# Altium schematic sheet AutomaticSolarTracker.SchDoc
size 863 x 558 mm; SheetNumber: 1; SheetTotal: 1
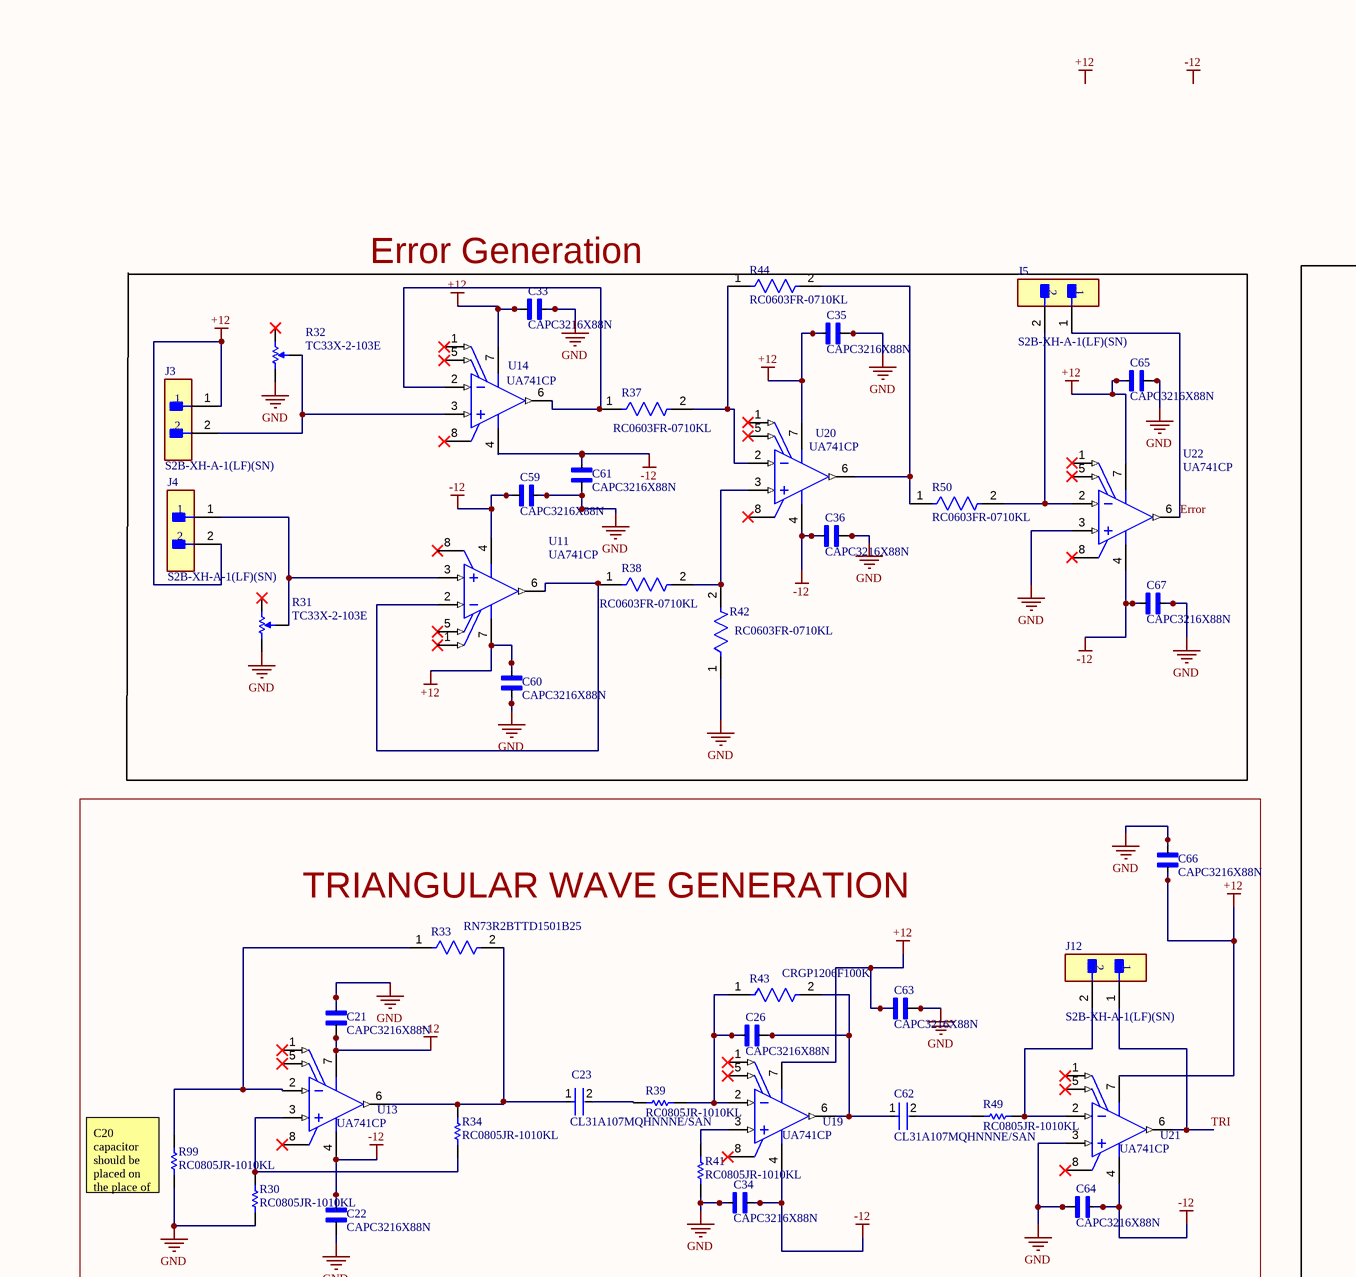
[diagram p0: AutomaticSolarTracker.SchDoc, top left]
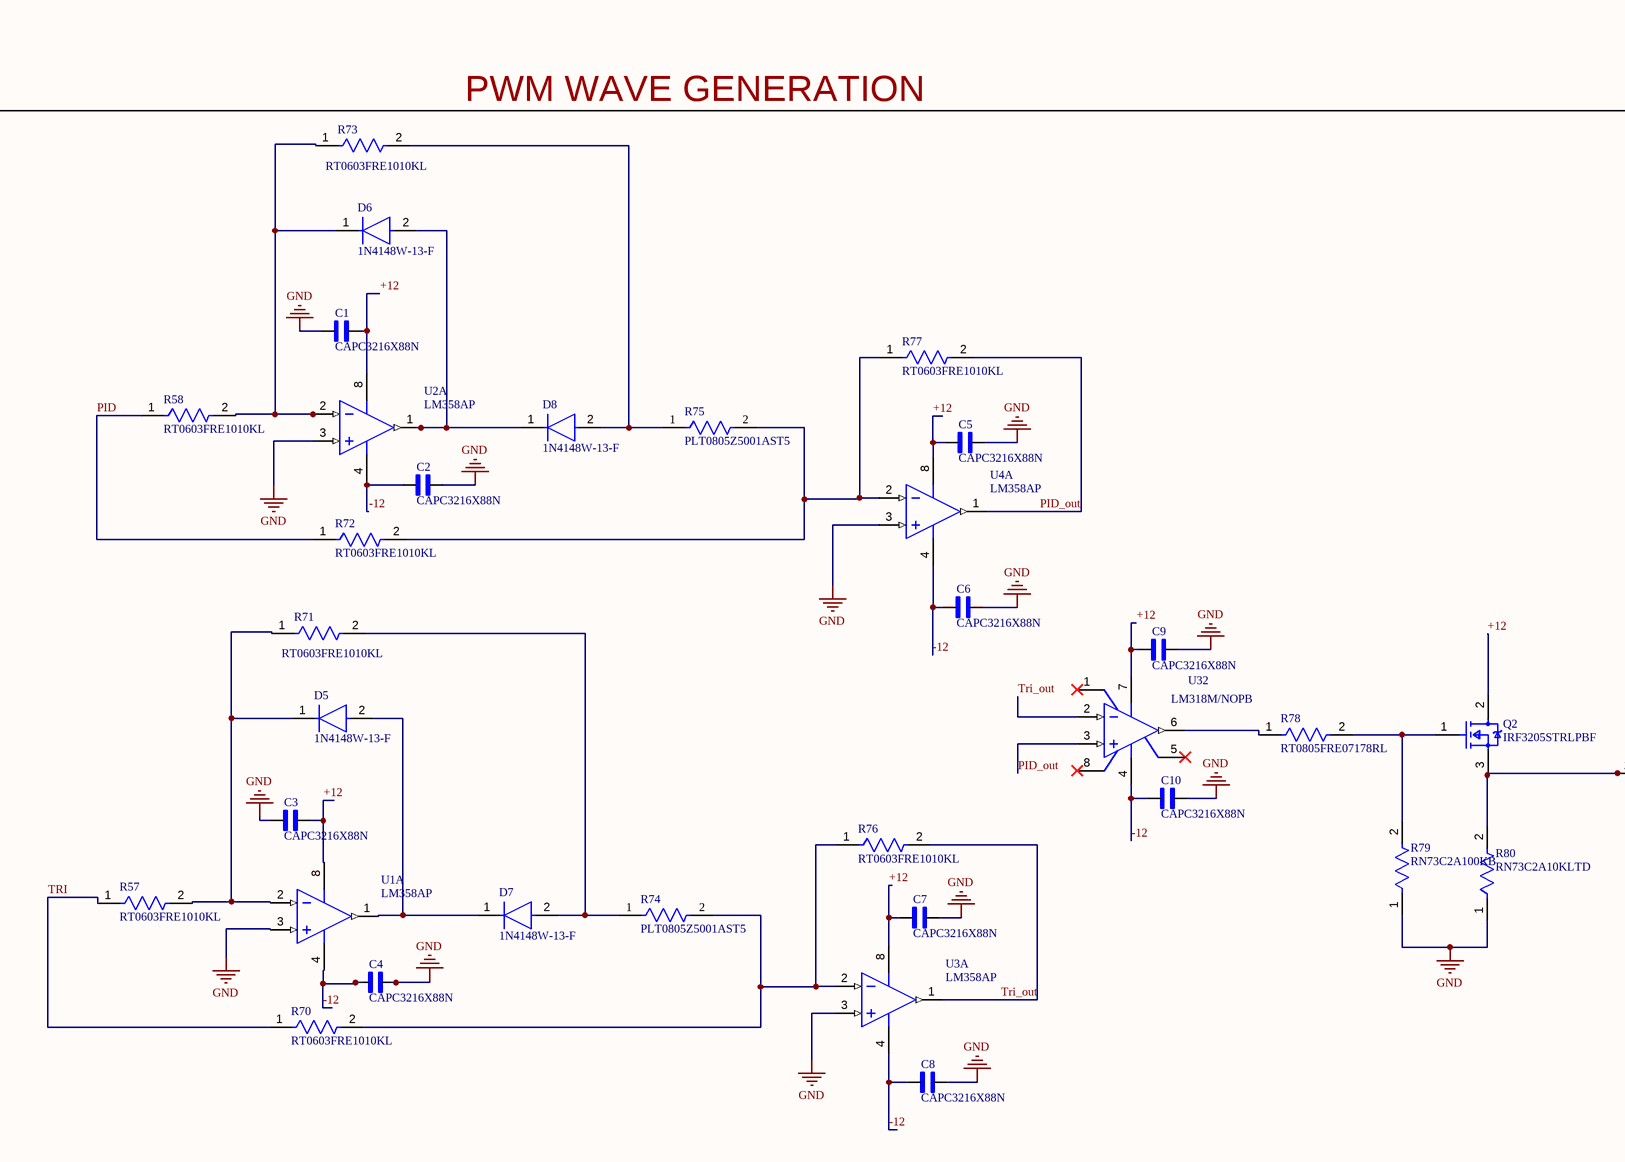
[diagram p1: AutomaticSolarTracker.SchDoc, top middle]
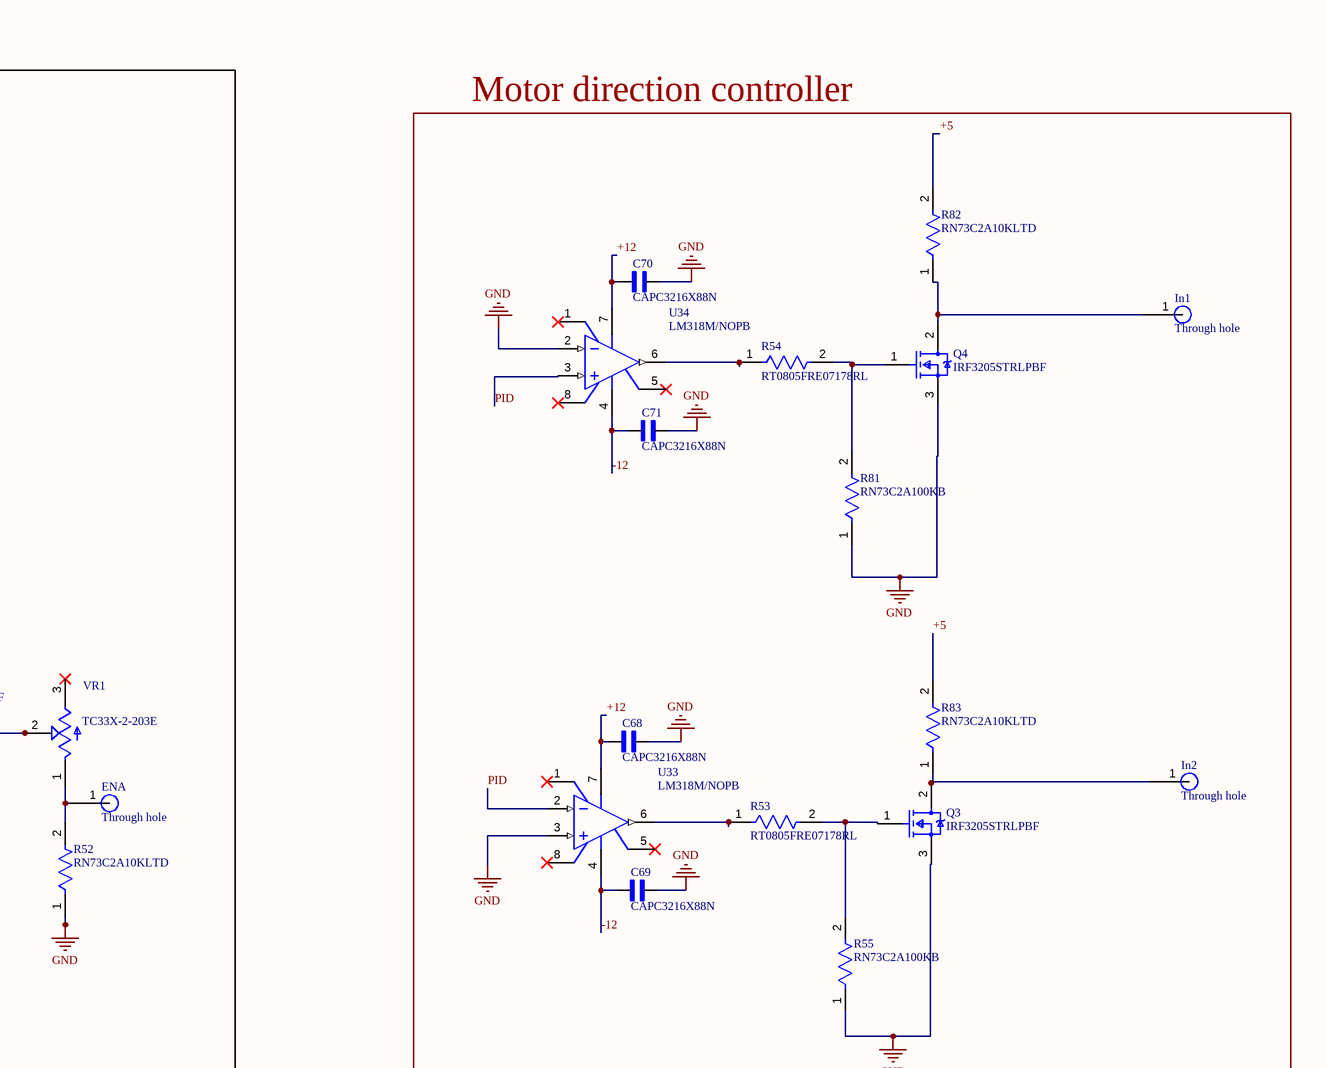
[diagram p2: AutomaticSolarTracker.SchDoc, top right]
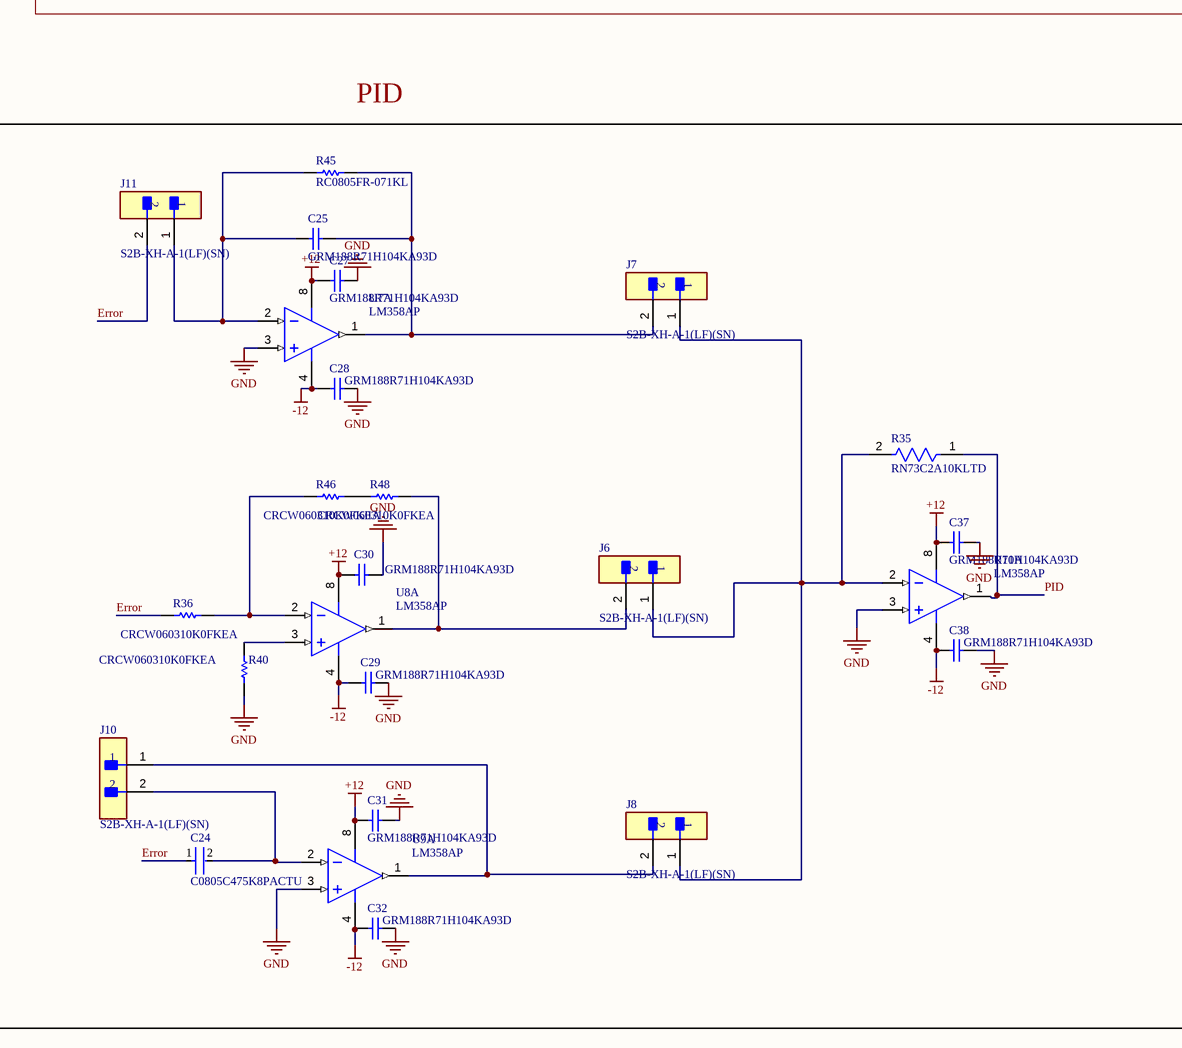
[diagram p3: AutomaticSolarTracker.SchDoc, bottom left]
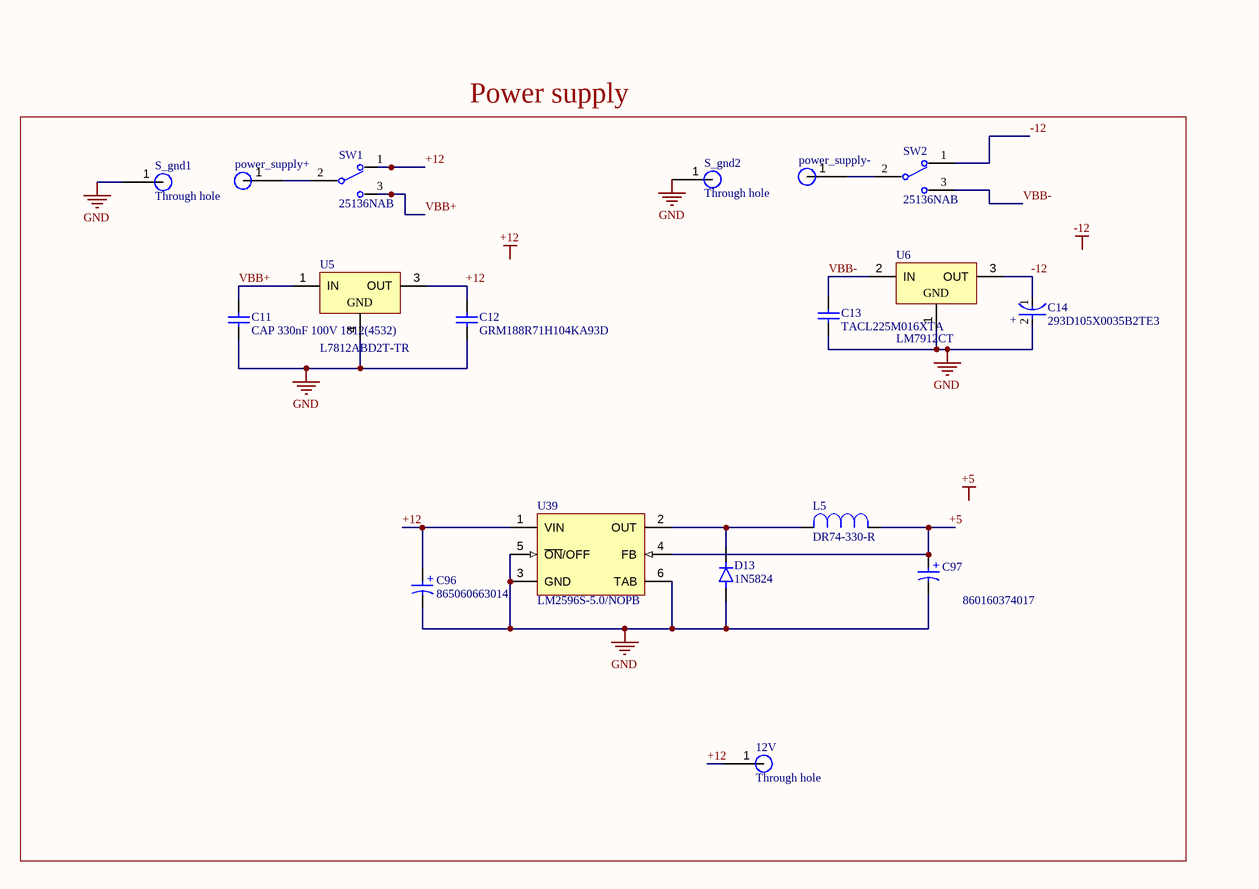
[diagram p4: AutomaticSolarTracker.SchDoc, bottom middle]

## Parts
12V  Through hole  [Through hole]
C1  CAPC3216X88N  [CAPC3216X88N.]
C2  CAPC3216X88N  [CAPC3216X88N.]
C3  CAPC3216X88N  [CAPC3216X88N.]
C4  CAPC3216X88N  [CAPC3216X88N.]
C5  CAPC3216X88N  [CAPC3216X88N.]
C6  CAPC3216X88N  [CAPC3216X88N.]
C7  CAPC3216X88N  [CAPC3216X88N.]
C8  CAPC3216X88N  [CAPC3216X88N.]
C9  CAPC3216X88N  [CAPC3216X88N.]
C10  CAPC3216X88N  [CAPC3216X88N.]
C11  CAP 330nF 100V 1812(4532)  [CAPC1812(4532)125_L]
C12  GRM188R71H104KA93D  [CAPC1608X90X35ML10T15]
C13  TACL225M016XTA  [CAPC1609X100X15ML20]
C14  293D105X0035B2TE3  [FP-293DB-MFG]
C21  CAPC3216X88N  [CAPC3216X88N.]
C22  CAPC3216X88N  [CAPC3216X88N.]
C23  CL31A107MQHNNNE/SAN  [FP-CL31-IPC_C]
C24  C0805C475K8PACTU  [FP-C0805C475K8PACTU-MFG]
C25  GRM188R71H104KA93D  [CAPC1608X90X35ML10T15]
C26  CAPC3216X88N  [CAPC3216X88N.]
C27  GRM188R71H104KA93D  [CAPC1608X90X35ML10T15]
C28  GRM188R71H104KA93D  [CAPC1608X90X35ML10T15]
C29  GRM188R71H104KA93D  [CAPC1608X90X35ML10T15]
C30  GRM188R71H104KA93D  [CAPC1608X90X35ML10T15]
C31  GRM188R71H104KA93D  [CAPC1608X90X35ML10T15]
C32  GRM188R71H104KA93D  [CAPC1608X90X35ML10T15]
C33  CAPC3216X88N  [CAPC3216X88N.]
C34  CAPC3216X88N  [CAPC3216X88N.]
C35  CAPC3216X88N  [CAPC3216X88N.]
C36  CAPC3216X88N  [CAPC3216X88N.]
C37  GRM188R71H104KA93D  [CAPC1608X90X35ML10T15]
C38  GRM188R71H104KA93D  [CAPC1608X90X35ML10T15]
C59  CAPC3216X88N  [CAPC3216X88N.]
C60  CAPC3216X88N  [CAPC3216X88N.]
C61  CAPC3216X88N  [CAPC3216X88N.]
C62  CL31A107MQHNNNE/SAN  [FP-CL31-IPC_C]
C63  CAPC3216X88N  [CAPC3216X88N.]
C64  CAPC3216X88N  [CAPC3216X88N.]
C65  CAPC3216X88N  [CAPC3216X88N.]
C66  CAPC3216X88N  [CAPC3216X88N.]
C67  CAPC3216X88N  [CAPC3216X88N.]
C68  CAPC3216X88N  [CAPC3216X88N.]
C69  CAPC3216X88N  [CAPC3216X88N.]
C70  CAPC3216X88N  [CAPC3216X88N.]
C71  CAPC3216X88N  [CAPC3216X88N.]
C96  865060663014  [WCAP-ASLL_D16H17]
C97  860160374017  [WCAP-ATLL_D8H11.5]
D5  1N4148W-13-F  [FP-SOD123-MFG]
D6  1N4148W-13-F  [FP-SOD123-MFG]
D7  1N4148W-13-F  [FP-SOD123-MFG]
D8  1N4148W-13-F  [FP-SOD123-MFG]
D13  1N5824  [DIOAD]
ENA  Through hole  [Through hole]
In1  Through hole  [Through hole]
In2  Through hole  [Through hole]
J3  S2B-XH-A-1(LF)(SN)  [FP-S2B-XH-A-1_LF_SN-MFG]
J4  S2B-XH-A-1(LF)(SN)  [FP-S2B-XH-A-1_LF_SN-MFG]
J5  S2B-XH-A-1(LF)(SN)  [FP-S2B-XH-A-1_LF_SN-MFG]
J6  S2B-XH-A-1(LF)(SN)  [FP-S2B-XH-A-1_LF_SN-MFG]
J7  S2B-XH-A-1(LF)(SN)  [FP-S2B-XH-A-1_LF_SN-MFG]
J8  S2B-XH-A-1(LF)(SN)  [FP-S2B-XH-A-1_LF_SN-MFG]
J10  S2B-XH-A-1(LF)(SN)  [FP-S2B-XH-A-1_LF_SN-MFG]
J11  S2B-XH-A-1(LF)(SN)  [FP-S2B-XH-A-1_LF_SN-MFG]
J12  S2B-XH-A-1(LF)(SN)  [FP-S2B-XH-A-1_LF_SN-MFG]
L5  DR74-330-R  [DR74-330-R]
power_supply+  (no value)  [Through hole]
power_supply-  (no value)  [Through hole]
Q2  IRF3205STRLPBF  [FP-PG-TO263-3-MFG]
Q3  IRF3205STRLPBF  [FP-PG-TO263-3-MFG]
Q4  IRF3205STRLPBF  [FP-PG-TO263-3-MFG]
R30  RC0805JR-1010KL  [RESC2013X60X35NL10T20]
R31  TC33X-2-103E  [BOUR-TC33X-2_V]
R32  TC33X-2-103E  [BOUR-TC33X-2_V]
R33  RN73R2BTTD1501B25  [FP-RN73R2B-IPC_A]
R34  RC0805JR-1010KL  [RESC2013X60X35NL10T20]
R35  RN73C2A10KLTD  [FP-RN732A-MFG]
R36  CRCW060310K0FKEA  [RESC1609X50X30NL8T20]
R37  RC0603FR-0710KL  [FP-RC0603-0_55-IPC_C]
R38  RC0603FR-0710KL  [FP-RC0603-0_55-IPC_C]
R39  RC0805JR-1010KL  [RESC2013X60X35NL10T20]
R40  CRCW060310K0FKEA  [RESC1609X50X30NL8T20]
R41  RC0805JR-1010KL  [RESC2013X60X35NL10T20]
R42  RC0603FR-0710KL  [FP-RC0603-0_55-IPC_C]
R43  CRGP1206F100K  [FP-CRGP1206-IPC_C]
R44  RC0603FR-0710KL  [FP-RC0603-0_55-IPC_C]
R45  RC0805FR-071KL  [RESC2013X60X35ML10T20]
R46  CRCW060310K0FKEA  [RESC1609X50X30NL8T20]
R48  CRCW060310K0FKEA  [RESC1609X50X30NL8T20]
R49  RC0805JR-1010KL  [RESC2013X60X35NL10T20]
R50  RC0603FR-0710KL  [FP-RC0603-0_55-IPC_C]
R52  RN73C2A10KLTD  [FP-RN732A-MFG]
R53  RT0805FRE07178RL  [FP-RT0805-MFG]
R54  RT0805FRE07178RL  [FP-RT0805-MFG]
R55  RN73C2A100KB  [FP-RN732A-MFG]
R57  RT0603FRE1010KL  [FP-RT0603-MFG]
R58  RT0603FRE1010KL  [FP-RT0603-MFG]
R70  RT0603FRE1010KL  [FP-RT0603-MFG]
R71  RT0603FRE1010KL  [FP-RT0603-MFG]
R72  RT0603FRE1010KL  [FP-RT0603-MFG]
R73  RT0603FRE1010KL  [FP-RT0603-MFG]
R74  PLT0805Z5001AST5  [FP-PLT0805-MFG]
R75  PLT0805Z5001AST5  [FP-PLT0805-MFG]
R76  RT0603FRE1010KL  [FP-RT0603-MFG]
R77  RT0603FRE1010KL  [FP-RT0603-MFG]
R78  RT0805FRE07178RL  [FP-RT0805-MFG]
R79  RN73C2A100KB  [FP-RN732A-MFG]
R80  RN73C2A10KLTD  [FP-RN732A-MFG]
R81  RN73C2A100KB  [FP-RN732A-MFG]
R82  RN73C2A10KLTD  [FP-RN732A-MFG]
R83  RN73C2A10KLTD  [FP-RN732A-MFG]
R99  RC0805JR-1010KL  [RESC2013X60X35NL10T20]
S_gnd1  Through hole  [Through hole]
S_gnd2  Through hole  [Through hole]
SW1  25136NAB  [FP-25136NAB-MFG]
SW2  25136NAB  [FP-25136NAB-MFG]
U1  LM358AP  [P0008A]  (part A of 2)
U2  LM358AP  [P0008A]  (part A of 2)
U3  LM358AP  [P0008A]  (part A of 2)
U4  LM358AP  [P0008A]  (part A of 2)
U5  L7812ABD2T-TR  [TO-263_L]
U6  LM7912CT  [NDE0003A]
U7  LM358AP  [P0008A]  (part A of 2)
U8  LM358AP  [P0008A]  (part A of 2)
U9  LM358AP  [P0008A]  (part A of 2)
U10  LM358AP  [P0008A]  (part A of 2)
U11  UA741CP  [P0008A]
U13  UA741CP  [P0008A]
U14  UA741CP  [P0008A]
U19  UA741CP  [P0008A]
U20  UA741CP  [P0008A]
U21  UA741CP  [P0008A]
U22  UA741CP  [P0008A]
U32  LM318M/NOPB  [D0008A_M]
U33  LM318M/NOPB  [D0008A_M]
U34  LM318M/NOPB  [D0008A_M]
U39  LM2596S-5.0/NOPB  [KTT0005B_M]
VR1  TC33X-2-203E  [TRIM_TC33X-2-203E]

## Blocks framed on the sheet
Error Generation: C33 C35 C36 C59-C61 C65 C67 J3-J5 R31 R32 R37 R38 R42 R44 R50 U11 U14 U20 U22
PWM WAVE GENERATION: C1-C10 D5-D8 ENA Q2 R52 R57 R58 R70-R80 U1-U4 U32 VR1
Motor direction controller: C68-C71 In1 In2 Q3 Q4 R53-R55 R81-R83 U33 U34
TRIANGULAR WAVE GENERATION: C21-C23 C26 C34 C62-C64 C66 J12 R30 R33 R34 R39 R41 R43 R49 R99 U13 U19 U21
PID: C24 C25 C27-C32 C37 C38 J6-J8 J10 J11 R35 R36 R40 R45 R46 R48 U7-U10
Power supply: 12V C11-C14 C96 C97 D13 L5 power_supply+ power_supply- S_gnd1 S_gnd2 SW1 SW2 U5 U6 U39

## Nets
+5: C97.1(P) L5.1 R82.2 R83.2 U39.4(FB)
+12: 12V.1(port) C1.2 C3.2 C5.1 C7.1 C9.1 C12.2 C21.1 C27.1 C30.1 C31.1 C33.1 C35.1 C37.1 C60.2 C63.1 C65.1 C66.1 C68.1 C70.1 C96.1(P) J3.1 J4.2 Q2.2(D) SW1.1 U1.8(VCC) U2.8(VCC) U3.8(VCC) U4.8(VCC) U5.3(OUT) U7.8(VCC) U8.8(VCC) U9.8(VCC) U10.8(VCC) U11.7(VCC+) U13.7(VCC+) U14.7(VCC+) U19.7(VCC+) U20.7(VCC+) U21.7(VCC+) U22.7(VCC+) U32.7(V+) U33.7(V+) U34.7(V+) U39.1(VIN)
-12: C2.1 C4.1 C6.1 C8.1 C10.1 C14.1(C) C22.2 C28.1 C29.1 C32.1 C34.2 C36.1 C38.1 C59.1 C61.2 C64.2 C67.1 C69.1 C71.1 SW2.1 U1.4(GND) U2.4(GND) U3.4(GND) U4.4(GND) U6.3(OUT) U7.4(GND) U8.4(GND) U9.4(GND) U10.4(GND) U11.4(VCC-) U13.4(VCC-) U14.4(VCC-) U19.4(VCC-) U20.4(VCC-) U21.4(VCC-) U22.4(VCC-) U32.4(V-) U33.4(V-) U34.4(V-)
GND: C1.1 C2.2 C3.1 C4.2 C5.2 C6.2 C7.2 C8.2 C9.2 C10.2 C11.1 C12.1 C13.1 C14.2(A) C21.2 C22.1 C27.2 C28.2 C29.2 C30.2 C31.2 C32.2 C33.2 C34.1 C35.2 C36.2 C37.2 C38.2 C59.2 C60.1 C61.1 C63.2 C64.1 C65.2 C66.2 C67.2 C68.2 C69.2 C70.2 C71.2 C96.2(N) C97.2(N) D13.A Q3.3(S) Q4.3(S) R30.1 R31.1 R32.1 R40.1 R41.2 R42.1 R52.1 R55.1 R79.1 R80.1 R81.1 R99.1 S_gnd1.1(port) S_gnd2.1(port) U1.3(1IN+) U2.3(1IN+) U3.3(1IN+) U4.3(1IN+) U5.4(GND) U6.1(GND) U7.3(1IN+) U9.3(1IN+) U10.3(1IN+) U21.3(IN+) U22.3(IN+) U33.3(IN+) U34.2(IN-) U39.3(GND) U39.5(~{ON}/OFF) U39.6(TAB)
Error: C24.1 J5.1 J11.2 R36.1 U22.6(OUT)
PID: R35.1 R58.1 R72.1 U10.1(1OUT) U33.2(IN-) U34.3(IN+)
PID_out: R77.2 U4.1(1OUT) U32.3(IN+)
TRI: J12.1 R57.1 R70.1 U21.6(OUT)
Tri_out: R76.2 U3.1(1OUT) U32.2(IN-)
VBB+: C11.2 SW1.3 U5.1(IN)
VBB-: C13.2 SW2.3 U6.2(IN)
NetC23_1: C23.1 R33.2 R34.1 U13.6(OUT)
NetC23_2: C23.2 R39.2
NetC24_2: C24.2 J10.2 U9.2(1IN-)
NetC25_1: C25.1 J11.1 R45.1 U7.2(1IN-)
NetC25_2: C25.2 J7.2 R45.2 U7.1(1OUT)
NetC26_1: C26.1 R39.1 R43.1 U19.2(IN-)
NetC26_2: C26.2 C62.1 R43.2 U19.6(OUT)
NetC62_2: C62.2 R49.2
NetD5_1: D5.1(C) R57.2 R71.1 U1.2(1IN-)
NetD5_2: D5.2(A) D7.1(C) U1.1(1OUT)
NetD6_1: D6.1(C) R58.2 R73.1 U2.2(1IN-)
NetD6_2: D6.2(A) D8.1(C) U2.1(1OUT)
NetD7_2: D7.2(A) R71.2 R74.1
NetD8_2: D8.2(A) R73.2 R75.1
NetD13_C: D13.C(K) L5.2 U39.2(OUT)
NetENA_1: ENA.1(port) R52.2 VR1.1(CCW)
NetIn1_1: In1.1(port) Q4.2(D) R82.1
NetIn2_1: In2.1(port) Q3.2(D) R83.1
NetJ3_2: J3.2 R32.2 U14.3(IN+)
NetJ4_1: J4.1 R31.2 U11.3(IN+)
NetJ5_2: J5.2 R50.2 U22.2(IN-)
NetJ6_1: J6.1 J7.1 J8.1 R35.2 U10.2(1IN-)
NetJ6_2: J6.2 R48.2 U8.1(1OUT)
NetJ8_2: J8.2 J10.1 U9.1(1OUT)
NetJ12_2: J12.2 R49.1 U21.2(IN-)
Netpower_supply+_1: power_supply+.1(port) SW1.2
Netpower_supply-_1: power_supply-.1(port) SW2.2
NetQ2_1: Q2.1(G) R78.2 R79.2
NetQ2_3: Q2.3(S) R80.2 VR1.2(W)
NetQ3_1: Q3.1(G) R53.2 R55.2
NetQ4_1: Q4.1(G) R54.2 R81.2
NetR30_2: R30.2 R34.2 U13.3(IN+)
NetR33_1: R33.1 R99.2 U13.2(IN-)
NetR36_2: R36.2 R46.1 U8.2(1IN-)
NetR37_1: R37.1 U14.2(IN-) U14.6(OUT)
NetR37_2: R37.2 R44.1 U20.2(IN-)
NetR38_1: R38.1 U11.2(IN-) U11.6(OUT)
NetR38_2: R38.2 R42.2 U20.3(IN+)
NetR40_2: R40.2 U8.3(1IN+)
NetR41_1: R41.1 U19.3(IN+)
NetR44_2: R44.2 R50.1 U20.6(OUT)
NetR46_2: R46.2 R48.1
NetR53_1: R53.1 U33.6(OUT)
NetR54_1: R54.1 U34.6(OUT)
NetR70_2: R70.2 R74.2 R76.1 U3.2(1IN-)
NetR72_2: R72.2 R75.2 R77.1 U4.2(1IN-)
NetR78_1: R78.1 U32.6(OUT)

Not connected (* = marked no-connect by the designer): R31 3*; R32 3*; U11 1(OFFSET_N1)* 5(OFFSET_N2)* 8(NC)*; U13 1(OFFSET_N1)* 5(OFFSET_N2)* 8(NC)*; U14 1(OFFSET_N1)* 5(OFFSET_N2)* 8(NC)*; U19 1(OFFSET_N1)* 5(OFFSET_N2)* 8(NC)*; U20 1(OFFSET_N1)* 5(OFFSET_N2)* 8(NC)*; U21 1(OFFSET_N1)* 5(OFFSET_N2)* 8(NC)*; U22 1(OFFSET_N1)* 5(OFFSET_N2)* 8(NC)*; U32 1(BAL/COMP1)* 5(BAL/COMP3)* 8(COMP2)*; U33 1(BAL/COMP1)* 5(BAL/COMP3)* 8(COMP2)*; U34 1(BAL/COMP1)* 5(BAL/COMP3)* 8(COMP2)*; VR1 3(CW)*

## Notes on the sheet
- (near R99) C20 capacitor should be placed on the place of R99
- Labels drawn without touching a wire or pin: +5, +12, -12
- DWG. NO.
- REV.
- SHT.
- REVISION
- DESCRIPTION
- DATE
- APPROVED
- THIS DOCUMENT AND THE DATA DISCLOSED HEREIN OR HEREWITH IS THE PROPERTY OF ALTIUM LIMITED AND MAY BE FREELY DISTRIBUTED IN WHOLE. NO RIGHTS ARE RESERVED OR EXPRESS OR IMPLIED WARANTEE GIVEN.
- ENG:
- DSN:
- APPROVALS
- PROJECT
- DOCUMENT REVISION:
- DESIGN ITEM:
- CHK:
- BOM:
- REFERENCE DOCUMENTS
- PROJECT REVISION:
- TITLE
- FAB DWG:
- PCB DWG:
- ASSY DWG:
- SCALE:
- SIZE
- D
- CAGE CODE
- FILE NAME
- DWG NO.
- SHEET
- OF
- REV
- (in symbol CMP-00030-42272077-1) +
- (in symbol CMP-03913-54202492-2) +
- (in symbol CMP-03913-55434149-1) +

## Library data of the parts
C1-C10 C21 C22 C26 C33-C36 C59-C61 C63-C71 = CAPC3216X88N: Multilayer Ceramic Capacitors MLCC - SMD/SMT 50V 0.1uF X7R 1206 10% AEC-Q200; Manufacturer: KEMET; Manufacturer Part Number: C1206C104K5RACAUTO; Value: 100nF; Supplier: Arrow Electronics; Supplier Part Number: C1206C104K5RACAUTO; RoHS: Compliant; Category: Ceramic Capacitors; Stock: 144000; Pricing: 4000=0.0257, 8000=0.024, 12000=0.023, 20000=0.023, 28000=0.022, 40000=0.022, 48000=0.022, 96000=0.021 (USD); Case/Package: 1206; Case Code (Imperial): 1206; Case Code (Metric): 3216; China RoHS: Compliant; Depth: 1.6mm; Dielectric: X7R; Dielectric Material: Ceramic; Height: 780µm; Length: 3.2mm; Lifecycle Status: Production; Material: Ceramic; Max Operating Temperature: 125°C; Min Operating Temperature: -55°C; Mounting Technology: Surface Mount; Number of Terminals: 2; Packaging: Cut Tape; Radiation Hardening: No; Ratings: AEC-Q200; REACH SVHC: Yes; Schedule B: 8532240020, 8532240020|8532240020|8532240020|8532240020|8532240020; Termination: SMD/SMT; Thickness: 889µm; Tolerance: 10%; Voltage Rating: 50V; Voltage Rating (DC): 50V; Width: 1.6mm; ComponentLink1URL: https://datasheet.octopart.com:443/C1206C104K5RACAUTO-KEMET-datasheet-178087915.pdf?src-supplier=IHS; ComponentLink1Description: https://datasheet.octopart.com:443/C1206C104K5RACAUTO-KEMET-datasheet-178087915.pdf?src-supplier=IHS; ComponentLink2URL: https://datasheet.octopart.com:443/C1206C104K5RACAUTO-KEMET-datasheet-138896532.pdf?src-supplier=Upverter; ComponentLink2Description: https://datasheet.octopart.com:443/C1206C104K5RACAUTO-KEMET-datasheet-138896532.pdf?src-supplier=Upverter; ComponentLink3URL: https://datasheet.octopart.com:443/C1206C104K5RACAUTO-KEMET-datasheet-103676457.pdf?src-supplier=element14+APAC; ComponentLink3Description: https://datasheet.octopart.com:443/C1206C104K5RACAUTO-KEMET-datasheet-103676457.pdf?src-supplier=element14+APAC; ComponentLink4URL: https://datasheet.octopart.com:443/C1206C104K5RACAUTO-Kemet-datasheet-21133269.pdf?src-supplier=element14+APAC; ComponentLink4Description: https://datasheet.octopart.com:443/C1206C104K5RACAUTO-Kemet-datasheet-21133269.pdf?src-supplier=element14+APAC; ComponentLink5URL: https://datasheet.octopart.com:443/C1206C104K5RACAUTO-KEMET-datasheet-74831893.pdf?src-supplier=element14+APAC; ComponentLink5Description: https://datasheet.octopart.com:443/C1206C104K5RACAUTO-KEMET-datasheet-74831893.pdf?src-supplier=element14+APAC; ComponentLink6URL: https://datasheet.octopart.com:443/C1206C104K5RACAUTO-Kemet-datasheet-66349228.pdf?src-supplier=element14+APAC; ComponentLink6Description: https://datasheet.octopart.com:443/C1206C104K5RACAUTO-Kemet-datasheet-66349228.pdf?src-supplier=element14+APAC; ComponentLink7URL: https://datasheet.octopart.com:443/C1206C104K5RACAUTO-KEMET-datasheet-138896278.pdf?src-supplier=Farnell; ComponentLink7Description: https://datasheet.octopart.com:443/C1206C104K5RACAUTO-KEMET-datasheet-138896278.pdf?src-supplier=Farnell; ComponentLink8URL: https://datasheet.octopart.com:443/C1206C104K5RACAUTO-Kemet-datasheet-14356739.pdf?src-supplier=Farnell; ComponentLink8Description: https://datasheet.octopart.com:443/C1206C104K5RACAUTO-Kemet-datasheet-14356739.pdf?src-supplier=Farnell; ComponentLink9URL: https://datasheet.octopart.com:443/C1206C104K5RAC-AUTO-Kemet-datasheet-11517047.pdf?src-supplier=Farnell; ComponentLink9Description: https://datasheet.octopart.com:443/C1206C104K5RAC-AUTO-Kemet-datasheet-11517047.pdf?src-supplier=Farnell; ComponentLink10URL: https://datasheet.octopart.com:443/C1206C104K5RACAUTO-Kemet-datasheet-66552770.pdf?src-supplier=Newark; ComponentLink10Description: https://datasheet.octopart.com:443/C1206C104K5RACAUTO-Kemet-datasheet-66552770.pdf?src-supplier=Newark; ComponentLink11URL: https://datasheet.octopart.com:443/C1206C104K5RAC-AUTO-Kemet-datasheet-10850653.pdf?src-supplier=Newark; ComponentLink11Description: https://datasheet.octopart.com:443/C1206C104K5RAC-AUTO-Kemet-datasheet-10850653.pdf?src-supplier=Newark; ComponentLink12URL: https://datasheet.octopart.com:443/C1206C104K5RACAUTO-KEMET-datasheet-175568790.pdf?src-supplier=Newark; ComponentLink12Description: https://datasheet.octopart.com:443/C1206C104K5RACAUTO-KEMET-datasheet-175568790.pdf?src-supplier=Newark; ComponentLink13URL: https://datasheet.octopart.com:443/C1206C104K5RACAUTO-KEMET-datasheet-101576563.pdf?src-supplier=Newark; ComponentLink13Description: https://datasheet.octopart.com:443/C1206C104K5RACAUTO-KEMET-datasheet-101576563.pdf?src-supplier=Newark; ComponentLink14URL: https://datasheet.octopart.com:443/C1206C104K5RACAUTO-Kemet-datasheet-66076775.pdf?src-supplier=Newark; ComponentLink14Description: https://datasheet.octopart.com:443/C1206C104K5RACAUTO-Kemet-datasheet-66076775.pdf?src-supplier=Newark; ComponentLink15URL: https://datasheet.octopart.com:443/C1206C104K5RACAUTO-KEMET-datasheet-142166320.pdf?src-supplier=Electro+Sonic; ComponentLink15Description: https://datasheet.octopart.com:443/C1206C104K5RACAUTO-KEMET-datasheet-142166320.pdf?src-supplier=Electro+Sonic; ComponentLink16URL: https://datasheet.octopart.com:443/C1206C104K5RACAUTO-KEMET-datasheet-130260129.pdf?src-supplier=TME; ComponentLink16Description: https://datasheet.octopart.com:443/C1206C104K5RACAUTO-KEMET-datasheet-130260129.pdf?src-supplier=TME; ComponentLink17URL: https://datasheet.octopart.com:443/C1206C104K5RACAUTO-KEMET-datasheet-130256447.pdf?src-supplier=TME; ComponentLink17Description: https://datasheet.octopart.com:443/C1206C104K5RACAUTO-KEMET-datasheet-130256447.pdf?src-supplier=TME; ComponentLink18URL: https://datasheet.octopart.com/C1206C104K5RACAUTO-KEMET-datasheet-84169754.pdf; ComponentLink18Description: https://datasheet.octopart.com/C1206C104K5RACAUTO-KEMET-datasheet-84169754.pdf; ComponentLink19URL: https://datasheet.octopart.com:443/C1206C104K5RACAUTO-Kemet-datasheet-11966466.pdf?src-supplier=Arrow+Electronics; ComponentLink19Description: https://datasheet.octopart.com:443/C1206C104K5RACAUTO-Kemet-datasheet-11966466.pdf?src-supplier=Arrow+Electronics
C11 = CMP-1040-01503-1: CAP 330nF 100V ±20% 1812 (4532 Metric) Thickness 1.25mm SMD; Case-Metric: 4532; Case-EIA: 1812; Tolerance: Â±20%; Rated Voltage: 100 V; Technology: SMT; Max Thickness: 1.25 mm; Value: 330nF
C12 C25 C27-C32 C37 C38 = CMP-2100-03643-1: Chip Capacitor, 0.1 uF, +/- 10%, 50 V, -55 to 125 degC, 0603 (1608 Metric), RoHS, Tape and Reel; Manufacturer: Murata; Dielectric Material: Ceramic; Voltage Rating: 50V; Capacitance: 100nF; Dielectric: X7R; Insulation Resistance: 10GR; Case Code (Metric): 1608; Lead Free: LeadFree; Depth: 0.8mm; Number of Pins: 2; Radiation Hardening: No; Case/Package: 0603; Manufacturer URL: http://www.murata.com/; Packaging: TapeandReel; Length: 1.6mm; Contact Plating: Tin; Datasheet URL: http://psearch.en.murata.com/capacitor/product/GRM188R71H104KA93%23.pdf; Tolerance: 10%; Case Code (Imperial): 0603; Min Operating Temperature: -55degC; RoHSCompliant: true; Voltage: 50V; Termination: SMD/SMT; Mount: SurfaceMount; Material: Ceramic; Package Quantity: 1; Height: 0.8mm; Thickness: 0.035inch; REACH SVHC: NoSVHC; Max Operating Temperature: 125degC; Width: 0.8mm; Package Reference: 0603; Voltage Rating (DC): 50V; Datasheet Version: 42675.0; Package Description: 2-Pin Surface Mount Device, Body 1.6 x 0.8 mm
C13 = CMP-2006-00199-1: Manufacturer: AVX Interconnect / Elco; Part Number: TACL225M016XTA
C14 = CMP-00030-42272077-1: 293D105X0035B2TE3 Cap Tant Solid 1uF 35V B CASE 20% (3.5 X 2.8 X 1.9mm) SMD 3528-21 5 Ohm 125 C T/R; Dissipation Factor: 4%; Capacitance: 1µF; Dielectric Material: Tantalum; Leakage Current: 500nA; Ripple Current: 100mA; ESR (Equivalent Series Resistance): 5Ω; Polarity: Polar; Case Code (Metric): 3528; Min Operating Temperature: -55°C; Height: 1.9mm; Voltage Rating (DC): 35V; Max Operating Temperature: 125°C; RoHS: Compliant; Lead Free: Lead Free; Termination: SMD/SMT; Radiation Hardening: No; NexarPartId: 42272077; Voltage Rating: 35V; Height - Seated (Max): 2.1082mm; Tolerance: 20%; Packaging: Tape and Reel; REACH SVHC: Unknown; Case Code (Imperial): 1411; Length: 3.5mm; Width: 1.9mm; Mount: Surface Mount; Schedule B: 8532210050; Features: General Purpose; Number of Pins: 2; Case/Package: 1411; Depth: 2.8mm
C23 C62 = CMP-13271-001839-1: Cap Ceramic 100uF 6.3V X5R ±20% SMD 1206 +85°C Embossed T/R
C24 = CMP-2007-01007-2: CAP CER 4.7UF 10V X5R 0805; Dielectric Material: Ceramic; Dissipation Factor: 5%; Tolerance: 10%; Lead Pitch: 0.75mm; Mount: Surface Mount; Voltage Rating (DC): 10V; Length: 2mm; Case Code (Imperial): 0805; Height: 1.25mm; Package Quantity: 1; Thickness: 0.055inch; Depth: 1.25mm; Case Code (Metric): 2012; Termination: SMD/SMT; Construction: Flat; Dielectric: X5R; Series: C; Capacitance: 4.7uF; Width: 1.2mm; Max Operating Temperature: 85°C; Packaging: Tape and Reel; Voltage Rating: 10V; REACH SVHC: No SVHC; Min Operating Temperature: -55°C; Number of Pins: 2; Case/Package: 0805; Radiation Hardening: No; Lead Free: Lead Free; Voltage: 10V; RoHS Compliant: Yes
C96 = CMP-03913-54202492-2: 865060663014 WCAP-ASLL Aluminum Electrolytic Capacitors; ESR (Equivalent Series Resistance): 58.3723mΩ; Polarity: Polar; Leakage Current: 340µA; Tolerance: 20%; Ripple Current (AC): 1.61A; Capacitance: 680µF; Voltage Rating (DC): 50V; Impedance: 73mΩ; Insulation Resistance: 147.059kΩ; Life (Hours): 5000hours; Height - Seated (Max): 16.9926mm; Length: 17mm; Max Operating Temperature: 105°C; Diameter: 16mm; Case/Package: Radial; Min Operating Temperature: -55°C; Mount: Surface Mount; RoHS: Compliant; Voltage Rating: 50V; REACH SVHC: Unknown; NexarPartId: 54202492; Ripple Current: 1.61A; Height: 17mm
C97 = CMP-03913-55434149-1: 860160374017 Aluminium Electrolytic Capacitor-Leaded Rohs Compliant: Yes; Pitch: 3.5mm; Leakage Current: 35.2µA; Ripple Current: 540mA; Capacitance: 220µF; Voltage Rating: 16V; Length: 11.5mm; NexarPartId: 55434149; Diameter: 8mm; RoHS: Non-Compliant
D5-D8 = CMP-12791-000005-1: DIODE GEN PURP 100V 150MA SOD123; Manufacturer: Diodes Inc.; Capacitance: 2pF; Forward Current: 300mA; Max Junction Temp: +150°C; Value: 2pF; Standoff Height: 0mm; Peak Reverse Current: 1uA; Max Surge Forward Current: 1A; Category: Diode; Height: 1.45mm; ComponentLink2URL: https://upverter.com/datasheet/628e7d6fee5901eee6eef4567d1c3569f2cd3cde.pdf; Lead Free: Yes; ComponentLink2Description: Datasheet; Octopart: https://octopart.com/1n4148w-13-f-diodes+inc.-2359612; Temperature Range High: +150°C; Device Class L2: Diodes; Digikey Description: DIODE GEN PURP 100V 150MA SOD123; Reverse Voltage: 100V; Temperature Range Low: -65°C; Device Class L1: Discrete Semiconductors; Package: SOD123; RoHS: TRUE; Manufacturer Part Number: 1N4148W-13-F; Footprint Url: https://www.diodes.com/assets/Package-Files/SOD123.pdf; Automotive: No; Max Repetitive Reverse Voltage: 100V; Mouser Description: 1N4148W Series 2 A 100 V 400 mW Surface Mount Fast Switching Diode - SOD-123; Temperature: -65°C to +150°C; Device Class L3: Rectifier Diodes
D13 = 1N5824: Rectifier Diode, Schottky, 1 Phase, 1 Element, 5A, 30V V(RRM), Silicon; Manufacturer: Microchip; Supplier: Arrow Electronics; Supplier Part Number: 1N5824; Manufacturer Part Number: 1N5824; Category: Rectifier Diodes; Pricing: 100=52.27, 250=51.75, 500=51.23, 1000=50.72, 2000=50.21, 2500=49.71, 3000=49.57 (USD); Projected EOL Date: 2049-02-05; Country of Assembly: United States of America; Country of Fabrication: United States of America; Country of Origin: USA; Export Control Classification Number (ECCN) Code: EAR99; Harmonized Tariff Schedule (HTS) Code: 8541.10.0080; Lifecycle Status: Production; Pins: 0; Packaging: Bulk; Schedule B: 8541100080; ComponentLink1URL: https://datasheet.octopart.com:443/1N5824-Microchip-datasheet-175858253.pdf?src-supplier=Electro+Sonic; ComponentLink1Description: https://datasheet.octopart.com:443/1N5824-Microchip-datasheet-175858253.pdf?src-supplier=Electro+Sonic; ComponentLink2URL: http://sigma.octopart.com:80/conflict_mineral_statement/Microchip-company-68.pdf?src-supplier=Compliance+Statements; ComponentLink2Description: http://sigma.octopart.com:80/conflict_mineral_statement/Microchip-company-68.pdf?src-supplier=Compliance+Statements; ComponentLink3URL: http://sigma.octopart.com:80/conflict_mineral_statement/Microchip-company-69.pdf?src-supplier=Compliance+Statements; ComponentLink3Description: http://sigma.octopart.com:80/conflict_mineral_statement/Microchip-company-69.pdf?src-supplier=Compliance+Statements; ComponentLink4URL: http://sigma.octopart.com:80/reach_statement/Microchip-company-70.pdf?src-supplier=Compliance+Statements; ComponentLink4Description: http://sigma.octopart.com:80/reach_statement/Microchip-company-70.pdf?src-supplier=Compliance+Statements; ComponentLink5URL: http://sigma.octopart.com:80/rohs_statement/Microchip-company-71.pdf?src-supplier=Compliance+Statements; ComponentLink5Description: http://sigma.octopart.com:80/rohs_statement/Microchip-company-71.pdf?src-supplier=Compliance+Statements
J3-J8 J10-J12 = CMP-17439-000260-1: CONN HEADER R/A 2POS 2.5MM; Voltage Rating: 250V; Number of Positions: 2; Contact Material: Brass; Series: XH; Contact Finish - Mating: TIN; Max Operating Temperature: 85°C; Number of Rows: 1; Packaging: Bulk; Insulation Color: Natural; Lead Free: Lead Free; Fastening Type: Detent; Termination: Press-Fit; Connector Type: Header; Insulation Material: Nylon; Contact Shape: Square; Contact Type: Male Pin; Mount: Through Hole; Min Operating Temperature: -25°C; Flammability Rating: UL94 V-0
L5 = DR74-330-R: Inductor Power Shielded Drum Core 33uH 20% 100KHz Ferrite 1.41A 143mOhm DCR T/R; Manufacturer: Eaton; DC Resistance (DCR): 143mΩ; Value: 33µH; Max DC Current: 1.73A; Number of Circuits: 1; Shielding: Yes; Supplier: Avnet; Supplier Part Number: DR74-330-R; Manufacturer Part Number: DR74-330-R; RoHS: Compliant; Category: Fixed Inductors; Stock: 9900; Pricing: 1100=0.85333, 2200=0.8366, 4400=0.82474, 6600=0.81322, 8800=0.8 (USD); Case/Package: 3030; Composition: Wirewound; Core Material: Ferrite; Current Rating: 1.41A; DC Current: 1.41A; Depth: 7.6mm; Height: 4.35mm; Height - Seated (Max): 4.3434mm; Inductance Tolerance: 20%; Lead Free: Lead Free; Length: 7.6mm; Lifecycle Status: Production; Max Current Rating: 1.41A; Max Operating Temperature: 125°C; Military Standard: Not; Min Operating Temperature: -40°C; Mounting Technology: Surface Mount; Pins: 2; Number of Terminals: 2; Packaging: Cut Tape; Radiation Hardening: No; REACH SVHC: No; RMS Current (Irms): 1.41A; Saturation Current: 1.73A; Schedule B: 8504500000, 8504500000|8504500000|8504500000|8504500000|8504500000|8504500000|8504500000|8504500000|8504500000|8504500000|8504500000|8504500000|8504500000|8504500000|8504500000|8504500000|8504500000|8504500000|8504500000|8504500000|8504500000|8504500000|8504500000|85; Self Resonant Frequency: 100kHz; ESR: 143mΩ; Termination: SMD/SMT; Test Frequency: 100kHz; Tolerance: 20%; Weight: 1.360777g; Width: 7.6mm; ComponentLink1URL: https://datasheet.octopart.com:443/DR74-330-R-Eaton-datasheet-129252529.pdf?src-supplier=Electro+Sonic; ComponentLink1Description: https://datasheet.octopart.com:443/DR74-330-R-Eaton-datasheet-129252529.pdf?src-supplier=Electro+Sonic; ComponentLink2URL: https://datasheet.octopart.com:443/DR74-330-R-Eaton-datasheet-552538.pdf?src-supplier=Electro+Sonic; ComponentLink2Description: https://datasheet.octopart.com:443/DR74-330-R-Eaton-datasheet-552538.pdf?src-supplier=Electro+Sonic; ComponentLink3URL: https://datasheet.octopart.com:443/DR74-330-R-Eaton-datasheet-41175520.pdf?src-supplier=Newark; ComponentLink3Description: https://datasheet.octopart.com:443/DR74-330-R-Eaton-datasheet-41175520.pdf?src-supplier=Newark; ComponentLink4URL: https://datasheet.octopart.com:443/DR74-330-R-Coiltronics-datasheet-8612520.pdf?src-supplier=IHS; ComponentLink4Description: https://datasheet.octopart.com:443/DR74-330-R-Coiltronics-datasheet-8612520.pdf?src-supplier=IHS; ComponentLink5URL: https://datasheet.octopart.com:443/DR74-330-R-Coiltronics-datasheet-3395.pdf?src-supplier=Factory+Futures; ComponentLink5Description: https://datasheet.octopart.com:443/DR74-330-R-Coiltronics-datasheet-3395.pdf?src-supplier=Factory+Futures; ComponentLink6URL: https://datasheet.octopart.com:443/DR74-330-R-Eaton-datasheet-37490916.pdf?src-supplier=RS+(Formerly+Allied+Electronics); ComponentLink6Description: https://datasheet.octopart.com:443/DR74-330-R-Eaton-datasheet-37490916.pdf?src-supplier=RS+(Formerly+Allied+Electronics); ComponentLink7URL: https://datasheet.octopart.com:443/DR74-330-R-Coiltronics-datasheet-3978.pdf?src-supplier=RS+(Formerly+Allied+Electronics); ComponentLink7Description: https://datasheet.octopart.com:443/DR74-330-R-Coiltronics-datasheet-3978.pdf?src-supplier=RS+(Formerly+Allied+Electronics); ComponentLink8URL: https://datasheet.octopart.com:443/DR74-330-R-Coiltronics-datasheet-119352.pdf?src-supplier=DigiKey; ComponentLink8Description: https://datasheet.octopart.com:443/DR74-330-R-Coiltronics-datasheet-119352.pdf?src-supplier=DigiKey
power_supply+ power_supply- = Through hole
Q2-Q4 = CMP-32901-000011-1: MOSFET N-CH 55V 110A D2PAK; Manufacturer: Infineon Technologies; Threshold Vgs Min: 2V; Turn Off Delay Time: 50ns; Pulse Drain Current: 390A; Max Forward Diode Voltage: 1.3V; Number Of Channels: 1; Threshold Vgs Max: 4V; Gate To Source Voltage: 20V; Input Capacitace At Vds: 3247pF @ 25V; Depletion Mode: False; Reverse Recovery Time: 69ns; Standoff Height: 0mm; Turn On Delay Time: 14ns; Gate Charge At Vgs: 146nC @ 10V; Drain To Source Resistance: 8mΩ; Rthja Max: 40°C/W; Power Dissipation: 200W; Max Junction Temp: +175°C; Reverse Recovery Charge: 143nC; ComponentLink2Description: Datasheet; Temperature Range Low: -55°C; ComponentLink2URL: https://www.infineon.com/dgdl/irf3205spbf.pdf?fileId=5546d462533600a4015355defac9190c; Automotive: No; Height: 5.084mm; Lead Free: Yes; Device Class L1: Discrete Semiconductors; Drain To Source Voltage: 55V; Device Class L3: MOSFETs; Temperature: -55°C to +175°C; Drain To Source Breakdown Voltage: 55V; Manufacturer Part Number: IRF3205STRLPBF; Temperature Range High: +175°C; Device Class L2: Transistors; Octopart: https://octopart.com/irf3205strlpbf-infineon-65873335; Digikey Description: MOSFET N-CH 55V 110A D2PAK; RoHS: TRUE; Number Of N Channels: 1; Continuous Drain Current: 110A; Category: Trans; Package: PG-TO263-3
R30 R34 R39 R41 R49 R99 = CMP-2001-01411-1: Manufacturer: Yageo; Part Number: RC0805JR-1010KL
R31 R32 = CMP-2100-03695-1: Trimming Potentiometer, 10000 Ohm, -40 to 100 degC, 3-Pin SMD, RoHS, Tape and Reel; Manufacturer: Bourns; Tolerance: 25%; Max Power Dissipation: 100mW; Number of Turns: 1; Resistance: 10KOhm; Temperature Coefficient: 250ppm/degreesC; Voltage Rating (DC): 50V; Datasheet URL: http://www.bourns.com/docs/Product-Datasheets/TC33.pdf; Composition: Potentiometer; Package Description: 3-Pin Surface Mount Device, Body 3.8 x 3.6 mm; Weight: 29.4mg; Power Rating: 100mW; Termination: FootPrint; Manufacturer URL: http://www.bourns.com/; Width: 0.118inch; Height: 0.047inch; Military Standard: Not; Radiation Hardening: No; Colour: Silver; Case/Package: SMD/SMT; Depth: 3.8mm; Min Operating Temperature: -40degC; Lead Free: LeadFree; Datasheet Version: 42583.0; REACH SVHC: NoSVHC; Length: 3mm; RoHSCompliant: true; Contact Plating: Silver; Taper: Linear; Packaging: TapeandReel; Mount: SurfaceMount; Max Operating Temperature: 100degC; Package Reference: TC33X-2; Package Quantity: 2500
R33 = CMP-04015-035236-1: 1.5kΩ ±0.1% 0.25W, 1/4W Chip Resistor 1206 (3216 Metric) Moisture Resistant Thin Film
R35 R52 R80 R82 R83 = CMP-03211-010648-1: SMD Chip Resistor, Thin Film, 10.LKΩ, 100 V, 0805 [2012 Metric], 100 mW, 0.1%, RN73 Series; Manufacturer: TE Connectivity; Tolerance: 42; Power Rating: 0.1W; Voltage Rating: 100V; Temperature Coefficient: 10ppm/°C; octopart_url: https://octopart.com/rn73c2a10kltd-te+connectivity-22738660; Category: Res; Lead Free: Yes; Ipc Land Pattern Name: RESC200125X55; Temperature Range Low: -55°C; Height: 0.65mm; Octopart: https://octopart.com/rn73c2a10kltd-te+connectivity-22738660; Device Class L3: Chip SMD Resistors; Temperature: -55°C to 155°C; ComponentLink2URL: https://www.te.com/commerce/DocumentDelivery/DDEController?Action=showdoc&DocId=Data+Sheet%7F1773270%7FP%7Fpdf%7FEnglish%7FENG_DS_1773270_P.pdf%7F1676162-2; packaging: 5000 Reel; RoHS: TRUE; Automotive: No; Device Class L1: Passive Components; Series: RN73; Value: 10.LKΩ; ComponentLink2Description: Datasheet; Package: RN732A; Device Class L2: Resistors; Temperature Range High: 155°C; Manufacturer Part Number: RN73C2A10KLTD; Resistance: 10.LKΩ; Composition: Thin Film
R36 R40 R46 R48 = CMP-1666-00005-4: Chip Resistor, 10 KOhm, +/- 1%, 100 mW, -55 to 155 degC, 0603 (1608 Metric), RoHS, Tape and Reel; Manufacturer: Vishay Semiconductor; Voltage Rating: 75 V; Max Operating Temperature: 155 degC; PackageDescription: 2-Pin Surface Mount Device, Body 1.575 x 0.85 mm; ComponentLink1Description: Manufacturer URL; RoHSCompliant: true; PackageReference: 0603; REACH SVHC: Unknown; Length: 1.55 mm; DatasheetVersion: 06/2012; Packaging: Tape and Reel; Min Operating Temperature: -55 degC; Mounting Technology: Surface Mount; ComponentLink2URL: https://datasheet.ciiva.com/11809/0900766b80d98afc-11809037.pdf; Height: 0.45 mm; ComponentLink2Description: Datasheet; Package Quantity: 5000; ComponentLink1URL: http://www.vishay.com/
R37 R38 R42 R44 R50 = CMP-2100-03664-2: RES 10K OHM 1% 1/10W 0603; Voltage Rating: 75V; Voltage Rating (DC): 50V; Resistance: 10kR; Power Rating: 100mW; Temperature Coefficient: 100ppm/°C; Depth: 0.8mm; Termination: SMD/SMT; Resistor Type: Thick Film; Series: RC; Construction: Rectangular; Features: Moisture Resistant; Packaging: Tape and Reel; Min Operating Temperature: -55°C; Number of Terminations: 2; Lead Pitch: 0.3mm; RoHS Compliant: Yes; Case/Package: 0603; Resistance Tolerance: 1%; Military Standard: Not; Weight: 7.1E-05oz; Number of Pins: 2; Tolerance: 1%; Length: 1.6mm; Case Code (Imperial): 0603; Lead Free: Lead Free; Width: 0.8mm; Max Power Dissipation: 100mW; Height: 0.45mm; Max Operating Temperature: 155°C; Case Code (Metric): 1608; Size Code: 0603
R43 = CMP-03211-001403-1: CRGP1206 100KΩ 0.5W ±100ppm/°C 1% 200V; Manufacturer: TE; Tolerance: 0.01; Power Rating: 0.5W; Ipc Land Pattern Name: RESC310155X55; Series: CRGP; Temperature Range Low: -55°C; Temperature Range High: +155°C; Temperature Coefficient: ±100ppm/°C; Temperature: -55°C to +155°C; Voltage Rating: 200V; Ambient Temperature Range High: +70°C; Height: 0.65mm; Automotive: No; Device Class L3: Chip SMD Resistors; ComponentLink2URL: https://www.mouser.com/datasheet/2/418/NG_DS_9-1773463-9_A-1358566.pdf; Composition: Thick Film; Category: Res; Resistance: 100KΩ; ComponentLink2Description: Datasheet; Package: CRGP1206; Value: 100KΩ; Lead Free: Yes; Manufacturer Part Number: CRGP1206F100K; RoHS: TRUE; Device Class L2: Resistors; Device Class L1: Passive Components; Octopart: https://octopart.com/crgp1206f100k-te+connectivity-91018841
R45 = CMP-2100-03671-1: Chip Resistor, 1 KOhm, +/- 1%, 125 mW, -55 to 155 degC, 0805 (2012 Metric), RoHS, Tape and Reel; Manufacturer: Yageo; Temperature Coefficient: 100ppm/degreesC; Voltage Rating (DC): 150V; Max Power Dissipation: 125mW; Resistance: 1KOhm; Number of Pins: 2; Number of Terminations: 2; Datasheet URL: http://www.yageo.com/NewPortal/yageodocoutput?fileName=/pdf/R-Chip/PYu-RC_Group_51_RoHS_L_5.pdf; Length: 0.079inch; Package Description: 2-Pin Surface Mounted Device, Body 2 x 1.25 mm; Depth: 1.25mm; Height: 0.024inch; Military Standard: Not; Case/Package: 0805; Package Reference: 0805; RoHSCompliant: true; Lead Free: LeadFree; Packaging: TapeandReel; Package Quantity: 1; Datasheet Version: Rev. 5, 10/2016; Tolerance: 1%; Min Operating Temperature: -55degC; Voltage Rating: 150V; Composition: ThickFilm; Case Code (Imperial): 0805; Power Rating: 125mW; Width: 0.049inch; Case Code (Metric): 2012; Manufacturer URL: http://www.yageo.com/; Max Operating Temperature: 155degC; REACH SVHC: Unknown; Termination: SMD/SMT
R53 R54 R78 = CMP-03412-011911-1: RES SMD 178 OHM 1% 1/8W 0805; Manufacturer: Yageo; Value: 178Ω; Voltage Rating: 150V; Power Rating: 0.125W; Tolerance: 0.0001; Temperature Coefficient: 50 ppm/°C; Lead Free: Yes; ComponentLink2URL: http://www.yageo.com/documents/recent/PYu-RT_1-to-0.01_RoHS_L_9.pdf; Temperature Range Low: -55°C; Resistance: 178Ω; Device Class L2: Resistors; ComponentLink2Description: Datasheet; Temperature Range High: +155°C; Digikey Description: RES SMD 178 OHM 1% 1/8W 0805; RoHS: TRUE; Manufacturer Part Number: RT0805FRE07178RL; Temperature: -55°C to +155°C; Height: 0.6mm; Mouser Description: Thin Film Resistors - SMD 1/8W 178 ohm 1% 50ppm; Series: RT; Automotive: No; Octopart: https://octopart.com/rt0805fre07178rl-yageo-1405991; Package: RT0805; Footprint Url: http://www.yageo.com/exep/pages/download/literatures/PYu-R_Mount_10.pdf; Ipc Land Pattern Name: RESC200125X50; Composition: Thin Film; Device Class L3: Chip SMD Resistors; Device Class L1: Passive Components; Category: Res
R55 R79 R81 = CMP-03211-001008-1: SMD Chip Resistor, Thin Film, 100KΩ, 100 V, 0805 [2012 Metric], 100 mW, 0.1%, RN73 Series; Manufacturer: TE Connectivity; Temperature Coefficient: 10ppm/°C; Voltage Rating: 100V; Power Rating: 0.1W; RoHS: TRUE; Resistance: 100KΩ; Category: Res; packaging: Custom; Lead Free: Yes; Ipc Land Pattern Name: RESC200125X55; Manufacturer Part Number: RN73C2A100KB; Device Class L1: Passive Components; Temperature: -55°C to 155°C; Composition: Thin Film; ComponentLink2URL: https://www.te.com/commerce/DocumentDelivery/DDEController?Action=showdoc&DocId=Data+Sheet%7F1773270%7FP%7Fpdf%7FEnglish%7FENG_DS_1773270_P.pdf%7F1676162-2; Value: 100KΩ; Device Class L2: Resistors; Series: RN73; Package: RN732A; octopart_url: https://octopart.com/rn73c2a100kb-te+connectivity-16078029; Automotive: No; Device Class L3: Chip SMD Resistors; Octopart: https://octopart.com/rn73c2a100kb-te+connectivity-16078029; Temperature Range Low: -55°C; Tolerance: 0.1%; Temperature Range High: 155°C; ComponentLink2Description: Datasheet; Height: 0.65mm
R57 R58 R70-R73 R76 R77 = CMP-03412-024264-1: RT0603 10KΩ 0.1W 50 ppm/°C 1.00%; Manufacturer: Yageo; Voltage Rating: 75V; Tolerance: 0.01; Temperature Range High: +155°C; Composition: Thin Film; Manufacturer Part Number: RT0603FRE1010KL; Lead Free: Yes; Temperature Range Low: -55°C; Octopart: https://octopart.com/rt0603fre1010kl-yageo-26185585; ComponentLink2URL: http://www.yageo.com/documents/recent/PYu-RT_1-to-0.01_RoHS_L_9.pdf; Category: Res; Value: 10KΩ; Temperature: -55°C to +155°C; Footprint Url: http://www.yageo.com/exep/pages/download/literatures/PYu-R_Mount_10.pdf; Device Class L3: Chip SMD Resistors; RoHS: TRUE; Temperature Coefficient: 50 ppm/°C; Device Class L1: Passive Components; Device Class L2: Resistors; Power Rating: 0.1W; Automotive: No; Resistance: 10KΩ; Ipc Land Pattern Name: RESC16080X45; Height: 0.55mm; Package: RT0603; ComponentLink2Description: Datasheet; Series: RT
R74 R75 = CMP-00030-44317389-1: PLT0805Z5001AST5 SMD Chip Resistor, 5 kOhm, ± 0.05%, 250 mW, 0805 [2012 Metric], Thin Film, Precision; Temperature Coefficient: 5ppm/°C; Resistance: 5kΩ; Voltage Rating: 100V; Power Rating: 250mW; Depth: 1.27mm; Length: 2.032mm; Case Code (Imperial): 0805; RoHS: Compliant; Case Code (Metric): 2012; Features: Moisture Resistant; Max Operating Temperature: 125°C; Min Operating Temperature: -55°C; Tolerance: 0.05%; NexarPartId: 44317389; Width: 1.27mm; Voltage Rating (DC): 100V; Max Power Dissipation: 250mW; Case/Package: 0805; Number of Terminations: 2; Composition: Thin Film; Schedule B: 8533210045; Military Standard: Not; Height: 838.2µm
SW1 SW2 = CMP-47022-000008-1: SWITCH SLIDE SPDT 4A 125V; Mechanical Life: 20000Cycles; Current Rating: 1A; Electrical Life: 10000Cycles; Max Voltage Rating (AC): 250V; Max Voltage Rating (DC): 30V; Switch Function: On-On; Contact Resistance: 10mR; Actuator Material: Nylon; Switch Travel: 4mm; Min Operating Temperature: -40°C; REACH SVHC: No SVHC; Mount: Through Hole; RoHS Compliant: Yes; Voltage Rating (AC): 125V; Termination: PC Pin; Packaging: Bulk; Throw Configuration: SPDT; Max Operating Temperature: 85°C; Contact Plating: Silver; Number of Pins: 2; Length: 14.1mm; Contact Current Rating: 1A; Contact Material: Silver; Actuator Type: SLIDE; Max Current Rating: 4A; Voltage Rating (DC): 30V; Package Quantity: 100; Series: 25000N; Orientation: Vertical; Depth: 7.5mm
U1-U4 U7-U10 = CMP-1685-00017-1: Dual Operational Amplifier, 3 to 32 V, 0 to 70 degC, 8-Pin PDIP (P), Pb-Free (RoHS), Tube; Case\Package: 0603; Luminous Intensity: 90 mcd; Viewing Angle: 130 degrees; Nominal Vf: 2 V; Lens Style: Diffused; Illumination Colour: Orange; Power Rating: 75 mW; Forward Current: 20 mA; Pins: 2; ComponentLink3Description: Package Specification; Packaging: Tape and Reel; Mount: Surface Mount; PackageReference: P0008A; Radiation Hardening: No; ComponentLink3URL: http://www.ti.com/lit/ml/mpdi001b/mpdi001b.pdf; Case Code (Metric): 1608; ComponentLink2Description: Datasheet; Max Operating Temperature: 85 degC; ComponentLink1Description: Manufacturer URL; RoHSCompliant: true; Width: 0.8 mm; Length: 1.6 mm; DatasheetVersion: SLOS068T, 04/2015; Min Operating Temperature: -55 degC; Height: 1.1 mm; Colour: Orange; ComponentLink2URL: http://www.ti.com/lit/ds/symlink/lm358a.pdf; PackageDescription: 8-Pin Double In-line Package, Body 9.59 x 6.35 mm, Pitch 2.54 mm; PackageVersion: 4040082/E, 04/2010; Forward Voltage: 2 V; Package Quantity: 3000; Case Code (Imperial): 0603; ComponentLink1URL: http://www.ti.com/
U5 = CMP-0244-00181-1: Positive Voltage Regulator, 3-Pin D2PAK, Tape and Reel; ComponentLink1Description: Manufacturer URL; ComponentLink2URL: http://www.st.com/internet/com/TECHNICAL_RESOURCES/TECHNICAL_LITERATURE/DATASHEET/CD00000444.pdf; PackageVersion: 2011; PackageDescription: 3-Pin Transistor Outline Package 2.54 mm Pitch, 15.4 mm Lead Span (D2PAK); DatasheetVersion: 16/11/2011; PackageReference: TO-263; ComponentLink1URL: http://www.st.com; ComponentLink2Description: Datasheet
U6 = CMP-0062-02472-3: 3-Terminal Negative Regulator, 3-pin TO-220; Manufacturer: Texas Instruments; CompType: LDO IC; PowerWise: N; PackageTopMarking: NSUZXYTTE#*LM7912CT; PinCount: 3; RoHS: N; PackageDescription: TO-220, Molded, 3 Lead, Straight; ComponentLink1URL: http://www.ti.com/general/docs/lit/getliterature.tsp?genericPartNumber=LM7912&fileType=pdf; PackageReference: NDE0003A; ComponentLink1Description: Datasheet URL
U11 U13 U14 U19-U22 = CMP-0017-00973-2: General-Purpose Operational Amplifier, 7 to 36 V, 0 to 70 degC, 8-pin DIP (P8), Pb-Free (RoHS); Manufacturer: Texas Instruments; Iq per channel(Max)(mA): 2.8; Number of Channels: 1; Total Supply Voltage(Min)(+5V is 5, +/-5V is 10): 7; IIB(Max)(pA): 800000; Slew Rate(Typ)(V/us): 0.5; Total Supply Voltage(Max)(+5V is 5, +/-5V is 10): 36; Vio (25C)(Max)(mV): 6; CMRR(Min)(dB): 70; Sub Family: General Purpose Amplifier, High Supply Voltage Amplifier (>=30V); PackageVersion: 4040082/E, 04/2010; PackageReference: P0008A; ComponentLink1URL: http://www.ti.com/; Mounting Technology: Through Hole; ComponentLink1Description: Manufacturer URL; GBW(Typ)(MHz): 1; ComponentLink2Description: Datasheet; ComponentLink2URL: http://www.ti.com/lit/ds/symlink/ua741.pdf; PartNumber: UA741CP; Code_JEDEC: MS-001; ComponentLink3Description: Package Specification; DatasheetVersion: SLOS094B; ComponentLink3URL: http://www.ti.com/litv/pdf/mpdi001b; PackageDescription: 8-Pin Plastic In-Line, Body 9.59 x 6.35 mm, Pitch 2.54 mm; Eco-Plan: Pb-Free (RoHS)
U32-U34 = CMP-0055-00770-3: Operational Amplifier, 8-pin Narrow SOIC, Pb-Free; Manufacturer: Texas Instruments; PackageTopMarking: NSZXTT*LM*318M; PowerWise: N; CompType: Amplifiers; PinCount: 8; PackageDescription: SOIC Narrow, 4.9 x 3.9 x 1.45mm, 8 Lead, 1.27mm Pitch; RoHS: Y; Package Reference: D0008A; Code_IPC: SOIC127P600-8; ComponentLink1URL: http://www.ti.com/general/docs/lit/getliterature.tsp?genericPartNumber=LM318-N&fileType=pdf; ComponentLink1Description: Datasheet URL; Code_JEDEC: MS-012-AA
U39 = CMP-0069-00269-3: SIMPLE SWITCHER® Power Converter 150 KHz 3A Step-Down Voltage Regulator, 5-pin TO-263, Pb-Free; Manufacturer: Texas Instruments; PowerWise: N; PackageTopMarking: NSUZXYTTE#*LM2596S*-5.0 P+; ComponentLink1URL: http://www.ti.com/general/docs/lit/getliterature.tsp?genericPartNumber=LM2596&fileType=pdf; PackageDescription: TO-263, Molded, .400 x .390 x .180in, 5 Lead, .067in Pitch, Surface Mount; RoHS: Y; PinCount: 5; Code_JEDEC: MO-169-AB; ComponentLink1Description: Datasheet URL; PackageReference: KTT0005B; CompType: Switcher
VR1 = TC33X-2-203E: 20 kOhms 0.1W, 1/10W J Lead Surface Mount Trimmer Potentiometer Cermet 1 Turn Top Adjustment; MF: Bourns; Value: *; SnapEDA_Link: https://www.snapeda.com/parts/TC33X-2-203E/Bourns/view-part/312812/?ref=snap; Check_prices: https://www.snapeda.com/parts/TC33X-2-203E/Bourns/view-part/312812/?ref=eda; Digi-Key_Part_Number: TC33X-2-203ECT-ND; Purchase-URL: https://pricing.snapeda.com/search/part/TC33X-2-203E/?ref=eda; Package: 1608 Bourns; MP: TC33X-2-203E